# Altium schematic sheet stm32f103.SchDoc
size A
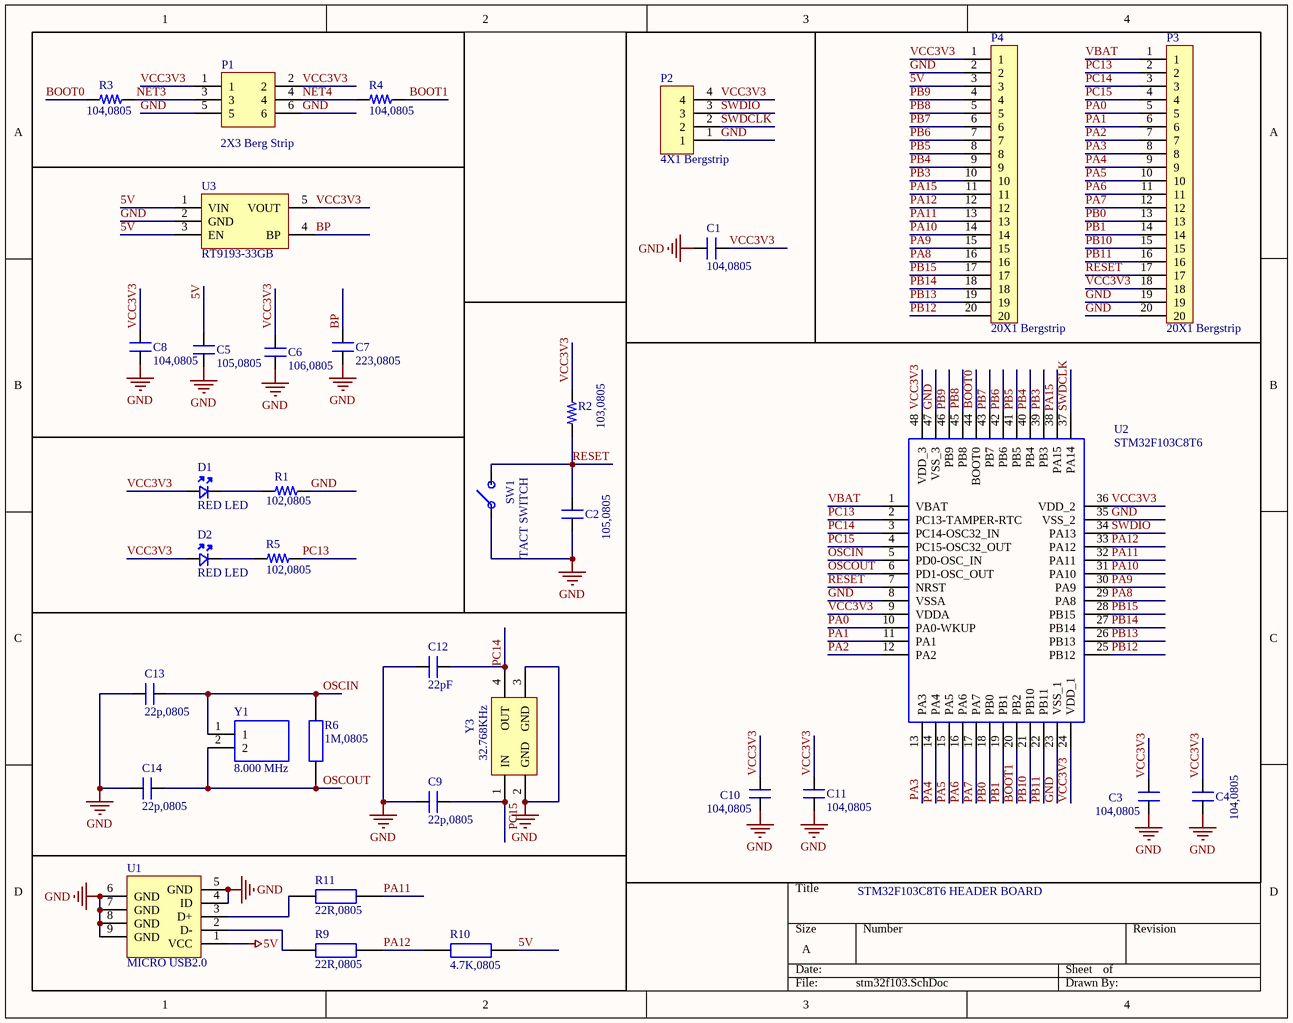
[diagram p0: stm32f103.SchDoc]

## Parts
C1  104,0805  [CAP_0805]
C2  105,0805  [CAP_0805]
C3  104,0805  [CAP_0805]
C4  104,0805  [CAP_0805]
C5  105,0805  [CAP_0805]
C6  106,0805  [CAP_0805]
C7  223,0805  [CAP_0805]
C8  104,0805  [CAP_0805]
C9  22p,0805  [CAP_0805]
C10  104,0805  [CAP_0805]
C11  104,0805  [CAP_0805]
C12  22pF  [CAP_0805]
C13  22p,0805  [CAP_0805]
C14  22p,0805  [CAP_0805]
D1  RED LED  [LED_0805]
D2  RED LED  [LED_0805]
P1  2X3 Berg Strip  [CON6_100_59D78_TH_ST_Duplicate]
P2  4X1 Bergstrip  [CON4_100_40D72_TH_ST_MALE]
P3  20X1 Bergstrip  [CON20_100_40D72_TH_ST]
P4  20X1 Bergstrip  [CON20_100_40D72_TH_ST]
R1  102,0805  [RES_0805]
R2  103,0805  [RES_0805]
R3  104,0805  [RES_0805]
R4  104,0805  [RES_0805]
R5  102,0805  [RES_0805]
R6  1M,0805  [RESC2013X65N]
R9  22R,0805  [RESC2013X65N]
R10  4.7K,0805  [RESC2013X65N]
R11  22R,0805  [RESC2013X65N]
SW1  TACT SWITCH  [SW_342_SMD]
U1  MICRO USB2.0  [CON_10118192-0001LF_SMD]
U2  STM32F103C8T6  [QFP50P900X900X160-48N]
U3  RT9193-33GB  [SOT23-5]
Y1  8.000 MHz  [HC-49S_1]
Y3  32.768KHz  [XTAL_MC-405 32.7680K-G3]

## Nets
5V: C5.2 P4.3 R10.2(R2) U1.1(VCC) U3.1(VIN) U3.3(EN)
GND: C1.1 C2.1 C3.1 C4.1 C5.1 C6.1 C7.1 C8.1 C9.1 C10.1 C11.1 C12.1 C13.1 C14.1 P1.5 P1.6 P2.1 P3.19 P3.20 P4.2 R1.2 SW1.1 U1.4(ID) U1.5(GND) U1.6(GND) U1.7(GND) U1.8(GND) U1.9(GND) U2.8(VSSA) U2.23(VSS_1) U2.35(VSS_2) U2.47(VSS_3) U3.2(GND) Y3.2(GND) Y3.3(GND)
BOOT0: R3.1 U2.44(BOOT0)
BOOT1: R4.2 U2.20(PB2)
BP: C7.2 U3.4(BP)
NET3: P1.3 R3.2
NET4: P1.4 R4.1
OSCIN: C13.2 R6.2 U2.5(PD0-OSC_IN) Y1.1
OSCOUT: C14.2 R6.1 U2.6(PD1-OSC_OUT) Y1.2
PA0: P3.5 U2.10(PA0-WKUP)
PA1: P3.6 U2.11(PA1)
PA2: P3.7 U2.12(PA2)
PA3: P3.8 U2.13(PA3)
PA4: P3.9 U2.14(PA4)
PA5: P3.10 U2.15(PA5)
PA6: P3.11 U2.16(PA6)
PA7: P3.12 U2.17(PA7)
PA8: P4.16 U2.29(PA8)
PA9: P4.15 U2.30(PA9)
PA10: P4.14 U2.31(PA10)
PA11: P4.13 R11.2 U2.32(PA11)
PA12: P4.12 R9.2 R10.1(R1) U2.33(PA12)
PA15: P4.11 U2.38(PA15)
PB0: P3.13 U2.18(PB0)
PB1: P3.14 U2.19(PB1)
PB3: P4.10 U2.39(PB3)
PB4: P4.9 U2.40(PB4)
PB5: P4.8 U2.41(PB5)
PB6: P4.7 U2.42(PB6)
PB7: P4.6 U2.43(PB7)
PB8: P4.5 U2.45(PB8)
PB9: P4.4 U2.46(PB9)
PB10: P3.15 U2.21(PB10)
PB11: P3.16 U2.22(PB11)
PB12: P4.20 U2.25(PB12)
PB13: P4.19 U2.26(PB13)
PB14: P4.18 U2.27(PB14)
PB15: P4.17 U2.28(PB15)
PC13: P3.2 R5.2 U2.2(PC13-TAMPER-RTC)
PC14: C12.2 P3.3 U2.3(PC14-OSC32_IN) Y3.4(OUT)
PC15: C9.2 P3.4 U2.4(PC15-OSC32_OUT) Y3.1(IN)
RESET: C2.2 P3.17 R2.1 SW1.2 U2.7(NRST)
SWDCLK: P2.2 U2.37(PA14)
SWDIO: P2.3 U2.34(PA13)
VBAT: P3.1 U2.1(VBAT)
VCC3V3: C1.2 C3.2 C4.2 C6.2 C8.2 C10.2 C11.2 D1.A D2.A P1.1 P1.2 P2.4 P3.18 P4.1 R2.2 U2.9(VDDA) U2.24(VDD_1) U2.36(VDD_2) U2.48(VDD_3) U3.5(VOUT)
NetD1_K: D1.K R1.1
NetD2_K: D2.K R5.1
NetR9_1: R9.1 U1.2(D-)
NetR11_1: R11.1 U1.3(D+)

## Notes on the sheet
- STM32F103C8T6 HEADER BOARD

## Library data of the parts
C1 C3 C4 C7 C8 C10 C11 = CAP_0.1uF-50V-5%-0805: 0.1µF ±5% 50V Ceramic Capacitor X7R 0805 (2012 Metric); Manufacturer: KEMET; Manufacturing Part Number: C0805C104J5RACTU; Case/Package: 0805 (2012 Metric); Supplier-1: Digikey; Supplier Part Number-1: 399-1171-1-ND
C2 C5 = CAP_1uF-50V-5%-0805: 1µF ±5% 50V Ceramic Capacitor X7R 0805 (2012 Metric); Manufacturer: Yageo; Manufacturing Part Number: CC0805JKX7R9BB105; Case/Package: 0805 (2012 Metric); Supplier-1: Digikey; Supplier Part Number-1: 311-3498-1-ND
C6 = CAP_1uF-50V-5%-0805: 10µF ±5% 50V Ceramic Capacitor X7R 0805 (2012 Metric); Manufacturer: Yageo; Manufacturing Part Number: CC0805JKX7R9BB105; Case/Package: 0805 (2012 Metric); Supplier-1: Digikey; Supplier Part Number-1: 311-3498-1-ND
C9 C12-C14 = CAP_22pF-50V-5%-0805: 22pF ±5% 50V Ceramic Capacitor C0G, NP0 0805 (2012 Metric); Manufacturer: KEMET; Manufacturer Part Number: C0805C220J5GACTU; Case/Package: 0805; Supplier-1: Digikey; Supplier Part Number-1: 399-1113-1-ND
D1 D2 = LED-RED_10mA-0805: Red 621nm LED Indication - Discrete 2V 0805 (2012 Metric); Manufacturer: Lite-On Inc.; Manufacturer Part Number: LTST-C170EKT; Case/ Package: 0805; Supplier-1: Digikey; Supplier Part Number-1: 160-1178-1-ND
P1 = CON-BS-PLG_2X3-100-TH-ST: 6 pin, 2 row, 2.54mm pitch bergstrip; Manufacturer: NA; Manufacturer Part Number: NA; Case/Package: TH; Supplier-1: NA; Supplier Part Number-1: NA
P2 = CON-BS-PLG_4X1-100-TH-ST: 4 pin, 1 row, 2.54mm pitch bergstrip; Manufacturer: NA; Manufacturing Part Number: NA; Case/Package: TH; Supplier-1: NA; Supplier Part Number-1: NA
P3 P4 = CON-BS-PLG_20X1-100-TH-ST: 20 pin, 1 row, 2.54mm pitch bergstrip; Manufacturer: NA; Manufacturing Part Number: NA; Case/Package: TH; Supplier-1: NA; Supplier Part Number-1: NA
R1 R5 = RES_1K-0.125W-1%-0805: 1 kOhms ±1% 0.125W, 1/8W Chip Resistor 0805 (2012 Metric) Moisture Resistant Thick Film; Manufacturer: 垈㎵á; Manufacturer Part Number: RC0805FR-071KL; Case/Package: 0805; Supplier-1: Digikey; Supplier Part Number-1: 311-1.00KCRCT-ND
R2-R4 = RES_10K-0.125W-1%-0805: 10 kOhms ±1% 0.125W, 1/8W Chip Resistor 0805 (2012 Metric) Moisture Resistant Thick Film; Manufacturer: Yageo; Manufacturing Part Number: RC0805FR-0710KL; Case/Package: 0805; Supplier-1: Digikey; Supplier Part Number-1: 311-10.0KCRCT-ND
R6 = CRGS0805J1M0: TE Connectivity CRGS Series Thick Film Anti-surge Resistor 0805 Case 1M +/-5% 0.5W +/-100ppm/C; Geometry.Height: 0.65mm; Manufacturer_Name: TE Connectivity; Manufacturer_Part_Number: CRGS0805J1M0; Mouser Part Number: *; Mouser Price/Stock: *; RS Part Number: 9059767; RS Price/Stock: https://uk.rs-online.com/web/p/products/9059767; Datasheet Link: http://www.te.com/commerce/DocumentDelivery/DDEController?Action=showdoc&DocId=Data+Sheet%7F9-1773463-8%7FB%7Fpdf%7FEnglish%7FENG_DS_9-1773463-8_B.pdf%7F3-2176243-7
R9 R11 = CRGH0805J22R: TE Connectivity Thick Film Surface Mount Fixed Resistor 0805 Case 22 +/-5% 0.33W +/-200ppm/C; Geometry.Height: 0.65mm; Manufacturer_Name: TE Connectivity; Manufacturer_Part_Number: CRGH0805J22R; Mouser Part Number: 279-CRGH0805J22R; Mouser Price/Stock: https://www.mouser.com/Search/Refine.aspx?Keyword=279-CRGH0805J22R; RS Part Number: 8075740; RS Price/Stock: https://uk.rs-online.com/web/p/products/8075740; Datasheet Link: http://docs-europe.electrocomponents.com/webdocs/12d7/0900766b812d7379.pdf
R10 = ERJ-6GEYJ472V: RESISTOR, 0805 4.7K Ohm +/-5% 0.125 W; Manufacturer_Name: Panasonic; Allied_Number: 70266150; Manufacturer_Part_Number: ERJ-6GEYJ472V; Mouser Part Number: 667-ERJ-6GEYJ472V; Mouser Price/Stock: https://www.mouser.com/Search/Refine.aspx?Keyword=667-ERJ-6GEYJ472V; RS Part Number: *; RS Price/Stock: *; Allied Price/Stock: https://www.alliedelec.com/panasonic-erj-6geyj472v/70266150/; Datasheet Link: *
SW1 = SW_KSR223GLFG-SMD: Tactile Switch SPST-NO Top Actuated Surface Mount; Manufacturer: C&K; Manufacturing Part Number: KSR223GLFG; Case/Package: SMD; Supplier-1: Digikey; Supplier Part Number-1: 401-1704-1-ND
U1 = CON-USB_10118192-0002LF-SMD: USB - micro B USB 2.0 Receptacle Connector 5 Position Surface Mount, Right Angle; Manufacturer: Amphenol ICC (FCI); Manufacturing Part Number: 10118192-0002LF; Case/Package: SMD; Supplier-1: Digikey; Supplier Part Number-1: 609-5379-1-ND
U2 = STM32F103C8T6: STM32F103C8T6, 32 bit ARM Cortex M3 Microcontroller 72MHz 64kb Flash, 20kb RAM, USB I2C SPI 48-Pin LQFP; Manufacturer_Name: STMicroelectronics; Allied_Number: 70390993; Geometry.Height: 1.6mm; Manufacturer_Part_Number: STM32F103C8T6; Mouser Part Number: 511-STM32F103C8T6; Mouser Price/Stock: https://www.mouser.com/Search/Refine.aspx?Keyword=511-STM32F103C8T6; RS Part Number: 0402279P; RS Price/Stock: http://uk.rs-online.com/web/p/products/0402279P; Allied Price/Stock: http://www.alliedelec.com/stmicroelectronics-stm32f103c8t6/70390993/; Datasheet Link: http://www.st.com/st-web-ui/static/active/en/resource/technical/document/datasheet/CD00161566.pdf
U3 = REG_3.3V-5.5V-0.3A-SOT-23-5: Linear Voltage Regulator IC 1 Output 300mA SOT-23-5; Manufacturer: Richtek USA Inc.; Manufacturer Part Number: RT9193-33GB; Case/ Package: SOT-23-5; Supplier-1: Digikey; Supplier Part Number-1: 1028-1014-1-ND
Y1 = 9B-16.000MEEJ-B: TXC - 9B-16.000MEEJ-B - XTAL, 16.000MHZ, 18PF, HC-49S; Manufacturer_Name: TXC; Manufacturer_Part_Number: 9B-16.000MEEJ-B; Mouser Part Number: 717-9B-16.000MEEJ-B; Mouser Price/Stock: https://www.mouser.com/Search/Refine.aspx?Keyword=717-9B-16.000MEEJ-B; RS Part Number: *; RS Price/Stock: *; Datasheet Link: http://www.txccrystal.com/images/pdf/9b-accuracy.pdf
Y3 = XTAL_32.768KHz-MC-405 32.7680K-G3: Crystals SMD AT XTL MHZ +/-50PPM 12.5 PF 250 T/R; Manufacturer: Epson; Manufacturing Part Number: MC-405 32.7680K-G3: ROHS; Case/Package: SMD; Supplier-1: Mouser; Supplier Part Number-1: 732-MC405327680KG3RS